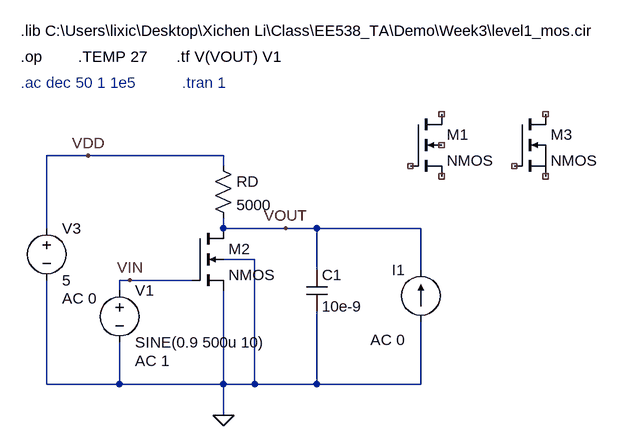
[diagram p0: schematic CS_AMP.asc]
CS_AMP.asc, the LTspice schematic file:
Version 4
SHEET 1 972 680
WIRE 16 32 -48 32
WIRE 224 32 16 32
WIRE 224 48 224 32
WIRE -48 144 -48 32
WIRE 224 144 224 128
WIRE 320 144 224 144
WIRE 368 144 320 144
WIRE 528 144 368 144
WIRE 272 192 224 192
WIRE 368 208 368 144
WIRE 528 208 528 144
WIRE 80 224 64 224
WIRE 176 224 80 224
WIRE 64 240 64 224
WIRE -48 384 -48 224
WIRE 64 384 64 320
WIRE 64 384 -48 384
WIRE 224 384 224 240
WIRE 224 384 64 384
WIRE 272 384 272 192
WIRE 272 384 224 384
WIRE 368 384 368 272
WIRE 368 384 272 384
WIRE 528 384 528 288
WIRE 528 384 368 384
WIRE 224 432 224 384
FLAG 224 432 0
FLAG 16 32 VDD
FLAG 80 224 VIN
FLAG 320 144 VOUT
DATAFLAG 144 224 ""
DATAFLAG 144 32 ""
DATAFLAG 400 144 ""
SYMBOL voltage 64 224 R0
WINDOW 123 24 124 Left 2
WINDOW 39 0 0 Left 0
SYMATTR Value2 AC 1
SYMATTR InstName V1
SYMATTR Value SINE(0.9 500u 10)
SYMBOL voltage -48 128 R0
WINDOW 123 24 124 Left 2
WINDOW 39 0 0 Left 0
SYMATTR Value2 AC 0
SYMATTR InstName V3
SYMATTR Value 5
SYMBOL res 208 32 R0
SYMATTR InstName RD
SYMATTR Value 5000
SYMBOL cap 352 208 R0
SYMATTR InstName C1
SYMATTR Value 10e-9
SYMBOL current 528 288 R180
WINDOW 0 24 80 Left 2
WINDOW 3 24 0 Left 2
WINDOW 123 24 -28 Left 2
WINDOW 39 0 0 Left 0
SYMATTR InstName I1
SYMATTR Value ""
SYMATTR Value2 AC 0
SYMBOL nmos4 176 144 R0
SYMATTR InstName M2
SYMATTR Value2 l=1e-6 w=100e-6
SYMBOL nmos4 512 -32 R0
SYMATTR InstName M1
SYMBOL nmos 672 -32 R0
SYMATTR InstName M3
TEXT -88 -160 Left 2 !.lib C:\\Users\\lixic\\Desktop\\Xichen Li\\Class\\EE538_TA\\Demo\\Week3\\level1_mos.cir
TEXT -88 -120 Left 2 !.op
TEXT 0 -120 Left 2 !.TEMP 27
TEXT 152 -120 Left 2 !.tf V(VOUT) V1
TEXT -88 -80 Left 2 ;.ac dec 50 1 1e5
TEXT 160 -80 Left 2 ;.tran 1

The netlist it stands for:
* CS_AMP.asc
V1 VIN 0 SINE(0.9 500u 10) AC 1
V3 VDD 0 5 AC 0
RD VDD VOUT 5000
C1 VOUT 0 10e-9
I1 0 VOUT AC 0
M2 VOUT VIN 0 0 NMOS l=1e-6 w=100e-6
M1 NC_01 NC_02 NC_03 NC_04 NMOS
M3 NC_05 NC_06 NC_07 NC_07 NMOS
.model NMOS NMOS
.model PMOS PMOS
.lib standard.mos
.lib C:\Users\lixic\Desktop\Xichen Li\Class\EE538_TA\Demo\Week3\level1_mos.cir
.op
.TEMP 27
.tf V(VOUT) V1
* .ac dec 50 1 1e5
* .tran 1
.backanno
.end